# Altium schematic sheet Power_Board_Control.SchDoc
size A4
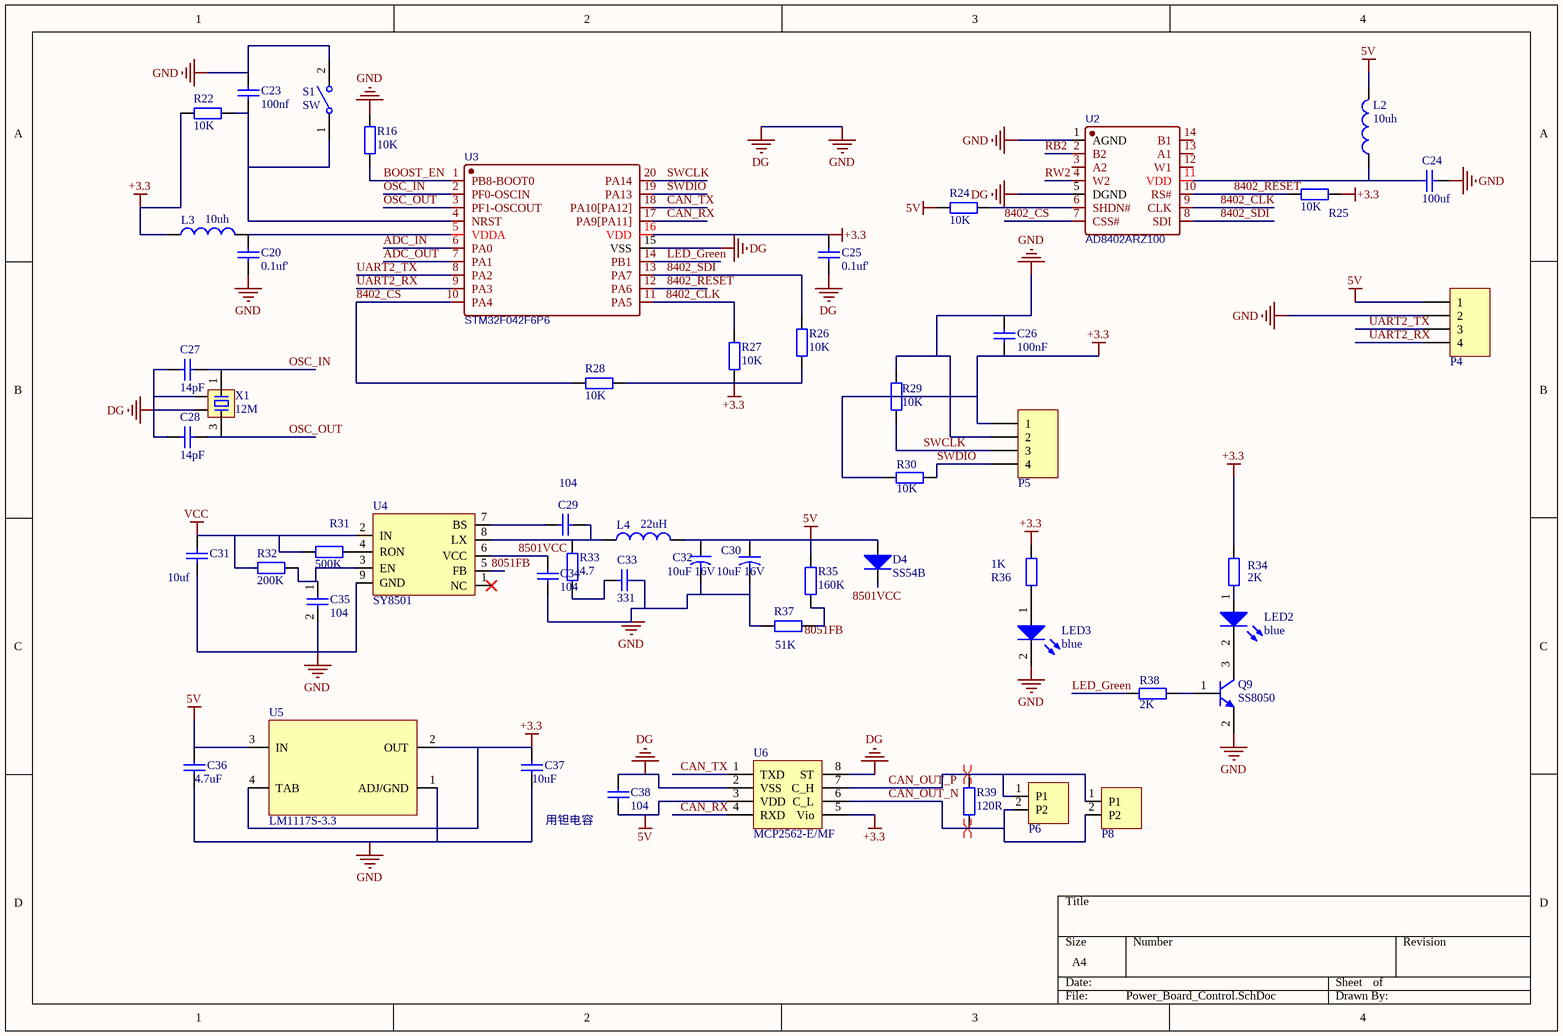
[diagram p0: Power_Board_Control.SchDoc]

## Parts
C20  value 0.1uf'  [c0402]  (hidden comment: 0.1uf)
C23  100nf  [c0402]
C24  100uf  [1210C]
C25  0.1uf'  [c0402]
C26  100nF  [c0402]
C27  value 14pF  [c0402]  (hidden comment: 27pf)
C28  value 14pF  [c0402]  (hidden comment: 27pf)
C29  104  [c0402]
C30  10uF 16V  [3216]
C31  10uf  [0805-1C]
C32  10uF 16V  [3216]
C33  331  [c0402]
C34  104  [c0402]
C35  104  [c0402]
C36  4.7uf  [0805-2]
C37  10uf  [3216]
C38  104  [c0402]
D4  SS54B  [DO-214]
L2  10uh  [l0805]
L3  10uh  [l0805]
L4  22uH  [CD54NP]
LED2  COLOR: blue  [led0805]  (hidden comment: LED_灯_黄)
LED3  COLOR: blue  [led0805]  (hidden comment: LED_灯_黄)
P4  Header 4  [gh1.25 4p 立贴]  (value not drawn)
P5  Header 4  [gh1.25 4p 立贴]  (value not drawn)
P6  P2  [gh1.25]  (value not drawn)
P8  P2  [gh1.25]  (value not drawn)
Q9  SS8050  [SOT-23]
R16  10K  [r0402]
R22  10K  [r0402]
R24  10K  [r0402]
R25  10K  [r0402]
R26  10K  [r0402]
R27  10K  [r0402]
R28  10K  [r0402]
R29  10K  [r0402]
R30  10K  [r0402]
R31  500K  [r0402]
R32  200K  [r0402]
R33  4.7  [r0402]
R34  2K  [r0402]
R35  160K  [r0402]
R36  1K  [r0402]
R37  51K  [r0402]
R38  2K  [r0402]
R39  120R  [r0402]
S1  SW  [KEY_SMD]
U2  AD8402ARZ100  [SOIC14]
U3  STM32F042F6P6  [TSSOP-20]
U4  SY8501  [SO8E]
U5  LM1117S-3.3  [sot-223]
U6  MCP2562-E/MF  [LM358]
X1  12M  [XTAL-3225]

## Nets
5V: C30.1 C32.1 C36.2 C38.2 D4.1(A) L2.2 L4.2 P4.1 R24.2 R35.1 U5.3(IN) U6.3(VDD)
+3.3: C25.1 C26.2 C37.2 L3.1 P5.1 R22.1 R25.1 R26.2 R27.2 R28.2 R30.1 R34.1 R36.2 U3.16(VDD) U5.2(OUT) U5.4(TAB) U6.5(Vio)
DG: C20.2 C23.1 C24.1 C25.2 C26.1 C27.2 C28.2 C30.2 C31.2 C32.2 C33.1 C34.2 C35.2 C36.1 C37.1 C38.1 LED3.2(K) P4.2 P5.2 Q9.2(E) R16.1 R29.1 R37.1 S1.2(NO) U2.1(AGND) U2.5(DGND) U3.15(VSS) U4.9(GND) U5.1(ADJ/GND) U6.2(VSS) U6.8(ST) X1.2 X1.4  [also labelled GND]
VCC: C31.1 R31.2 R32.2 U4.2(IN)
8051FB: R35.2 R37.2 U4.5(FB)
8402_CLK: R27.1 U2.9(CLK) U3.11(PA5)
8402_CS: R28.1 U2.7(CSS#) U3.10(PA4)
8402_RESET: R25.2 U2.10(RS#) U3.12(PA6)
8402_SDI: R26.1 U2.8(SDI) U3.13(PA7)
8501VCC: C34.1 D4.2(K) U4.6(VCC)
ADC_IN: U3.6(PA0)
ADC_OUT: U3.7(PA1)
BOOST_EN: R16.2 U3.1(PB8-BOOT0)
CAN_OUT_N: P6.2(P2) P8.2(P2) R39.1 U6.6(C_L)
CAN_OUT_P: P6.1(P1) P8.1(P1) R39.2 U6.7(C_H)
CAN_RX: U3.17(PA9[PA11]) U6.4(RXD)
CAN_TX: U3.18(PA10[PA12]) U6.1(TXD)
LED_Green: R38.1 U3.14(PB1)
OSC_IN: C27.1 U3.2(PF0-OSCIN) X1.1
OSC_OUT: C28.1 U3.3(PF1-OSCOUT) X1.3
RB2: U2.2(B2)
RW2: U2.4(W2)
SWCLK: P5.3 R29.2 U3.20(PA14)
SWDIO: P5.4 R30.2 U3.19(PA13)
UART2_RX: P4.4 U3.9(PA3)
UART2_TX: P4.3 U3.8(PA2)
NetC20_1: C20.1 L3.2 U3.5(VDDA)
NetC23_2: C23.2 R22.2 S1.1(COMMON) U3.4(NRST)
NetC24_2: C24.2 L2.1 U2.11(VDD)
NetC29_1: C29.1 L4.1 R33.1 U4.8(LX)
NetC29_2: C29.2 U4.7(BS)
NetC33_2: C33.2 R33.2
NetC35_1: C35.1 R32.1 U4.3(EN)
NetLED2_1: LED2.1(A) R34.2
NetLED2_2: LED2.2(K) Q9.3(C)
NetLED3_1: LED3.1(A) R36.1
NetQ9_1: Q9.1(B) R38.2
NetR24_1: R24.1 U2.6(SHDN#)
NetR31_1: R31.1 U4.4(RON)

Not connected (* = marked no-connect by the designer): U2 3(A2) 12(W1) 13(A1) 14(B1); U4 1(NC)*

## Layout directives
differential pair: CAN_OUT_N, CAN_OUT_P

## Notes on the sheet
- 用钽电容

## Library data of the parts
C20 C23-C29 C31 C33 C34 C36 C37 = Cap: 无极性电容; Published: 8-Jun-2000; LatestRevisionDate: 17-Jul-2002; LatestRevisionNote: Re-released for DXP Platform.; PackageReference: RAD-0.3; Publisher: Altium Limited
  C23: Value: 100nf
  C24: Value: 100uf
  C25: Value: 0.1uf'
  C26: Value: 100nF
  C29 C34: Value: 104
  C31: Value: 10uf
  C33: Value: 331
  C36: Value: 4.7uF
  C37: Value: 10uF
C30 C32 = CAP2: 贴片电解; Value: 337; Published: 23-Sep-2002; PackageReference: CAPR5-4X5; Publisher: Altium Limited; PackageDescription: Capacitor; 2 Leads
C35 = CAP-W: 贴片电容1206; U: *; C: 104
C38 = C: 贴片电容; BOM名称: 无极性贴片电容; 联系卖家，免费查找封装: 唯一出售店铺网址https://shop463601444.taobao.com; 封装库来自淘宝卖家ID：黄晶宝石: 其他店铺购入均为盗版假冒封装库，请立即申请退款
D4 = Diode: 肖特基二极管; Published: 8-Jun-2000; LatestRevisionDate: 17-Jul-2002; LatestRevisionNote: Re-released for DXP Platform.; PackageVersion: Sep-1996; PackageReference: SMC; Publisher: Altium Limited; PackageDescription: DO-214-AB/SMC; 2 C-Bend Leads; Body 7.9 x 5.9 mm, inc. leads (LxW); Code_JEDEC: DO-214-AB
L2-L4 = Inductor: 功率电感; Code_IEC: 1005; Value: 47uH; Published: 8-Jun-2000; LatestRevisionDate: 29-May-2009; LatestRevisionNote: IPC-7351 Footprint Added.; PackageReference: 0402-A; Publisher: Altium Limited; PackageDescription: Chip Inductor; Code_JEITA: 0402
LED2 LED3 = LED: 贴片LED
P4 P5 = Header 4: 排针; LatestRevisionDate: 17-Jul-2002; LatestRevisionNote: Re-released for DXP Platform.; Publisher: Altium Limited
Q9 = SS8050: NPN贴片三极管; Published: 8-Jun-2000; LatestRevisionDate: 15-Jan-2003; LatestRevisionNote: PCB Footprint 'BCY-W3/D4.7' replaced; DatasheetDocument: 1997; PackageDocument: Sep-1998; PackageReference: TO-92A; Publisher: Altium Limited; Code_JEDEC: TO-92A; ComponentLink1Description: Manufacturer Link; ComponentLink1URL: http://www.fairchildsemi.com/; ComponentLink2Description: Datasheet; ComponentLink2URL: http://www.fairchildsemi.com/ds/2N%2F2N3904.pdf
R16 R22 R24-R28 R31-R33 R35 R37 R39 = R: 贴片电阻; 联系卖家，免费查找封装: 唯一出售店铺网址https://shop463601444.taobao.com; 封装库来自淘宝卖家ID：黄晶宝石: 其他店铺购入均为盗版假冒封装库，请立即申请退款; BOM名称: 贴片电阻
R29 R30 R34 R36 R38 = Res1: 贴片电阻; Published: 8-Jun-2000; LatestRevisionDate: 17-Jul-2002; LatestRevisionNote: Re-released for DXP Platform.; PackageReference: AXIAL-0.4; Publisher: Altium Limited
  R29 R30: Value: 10K
  R34 R38: Value: 2K
  R36: Value: 1K
U2 = AD8402ARZ100: BOM_Manufacturer: ADI(亚德诺)/LINEAR; Contributor: LCSC; BOM_Supplier: LCSC; BOM_Supplier Part: C652776; BOM_Manufacturer Part: AD8402ARZ100; spicePre: U; spiceSymbolName: AD8402ARZ100
U3 = STM32F042F6P6: BOM_Manufacturer: STMicroelectronics; BOM_Supplier: LCSC; BOM_Manufacturer Part: STM32F042F6P6; BOM_Supplier Part: C81000; BOM_JLCPCB Part Class: Extended Part; spicePre: U; spiceSymbolName: STM32F042F6P6
U4 = SY8501: 电源管理芯片
U6 = TLP250
X1 = XTAL-4P: 4脚无源晶振